# EAGLE design base-6u-generic-xau4 (EAGLE 6.2)
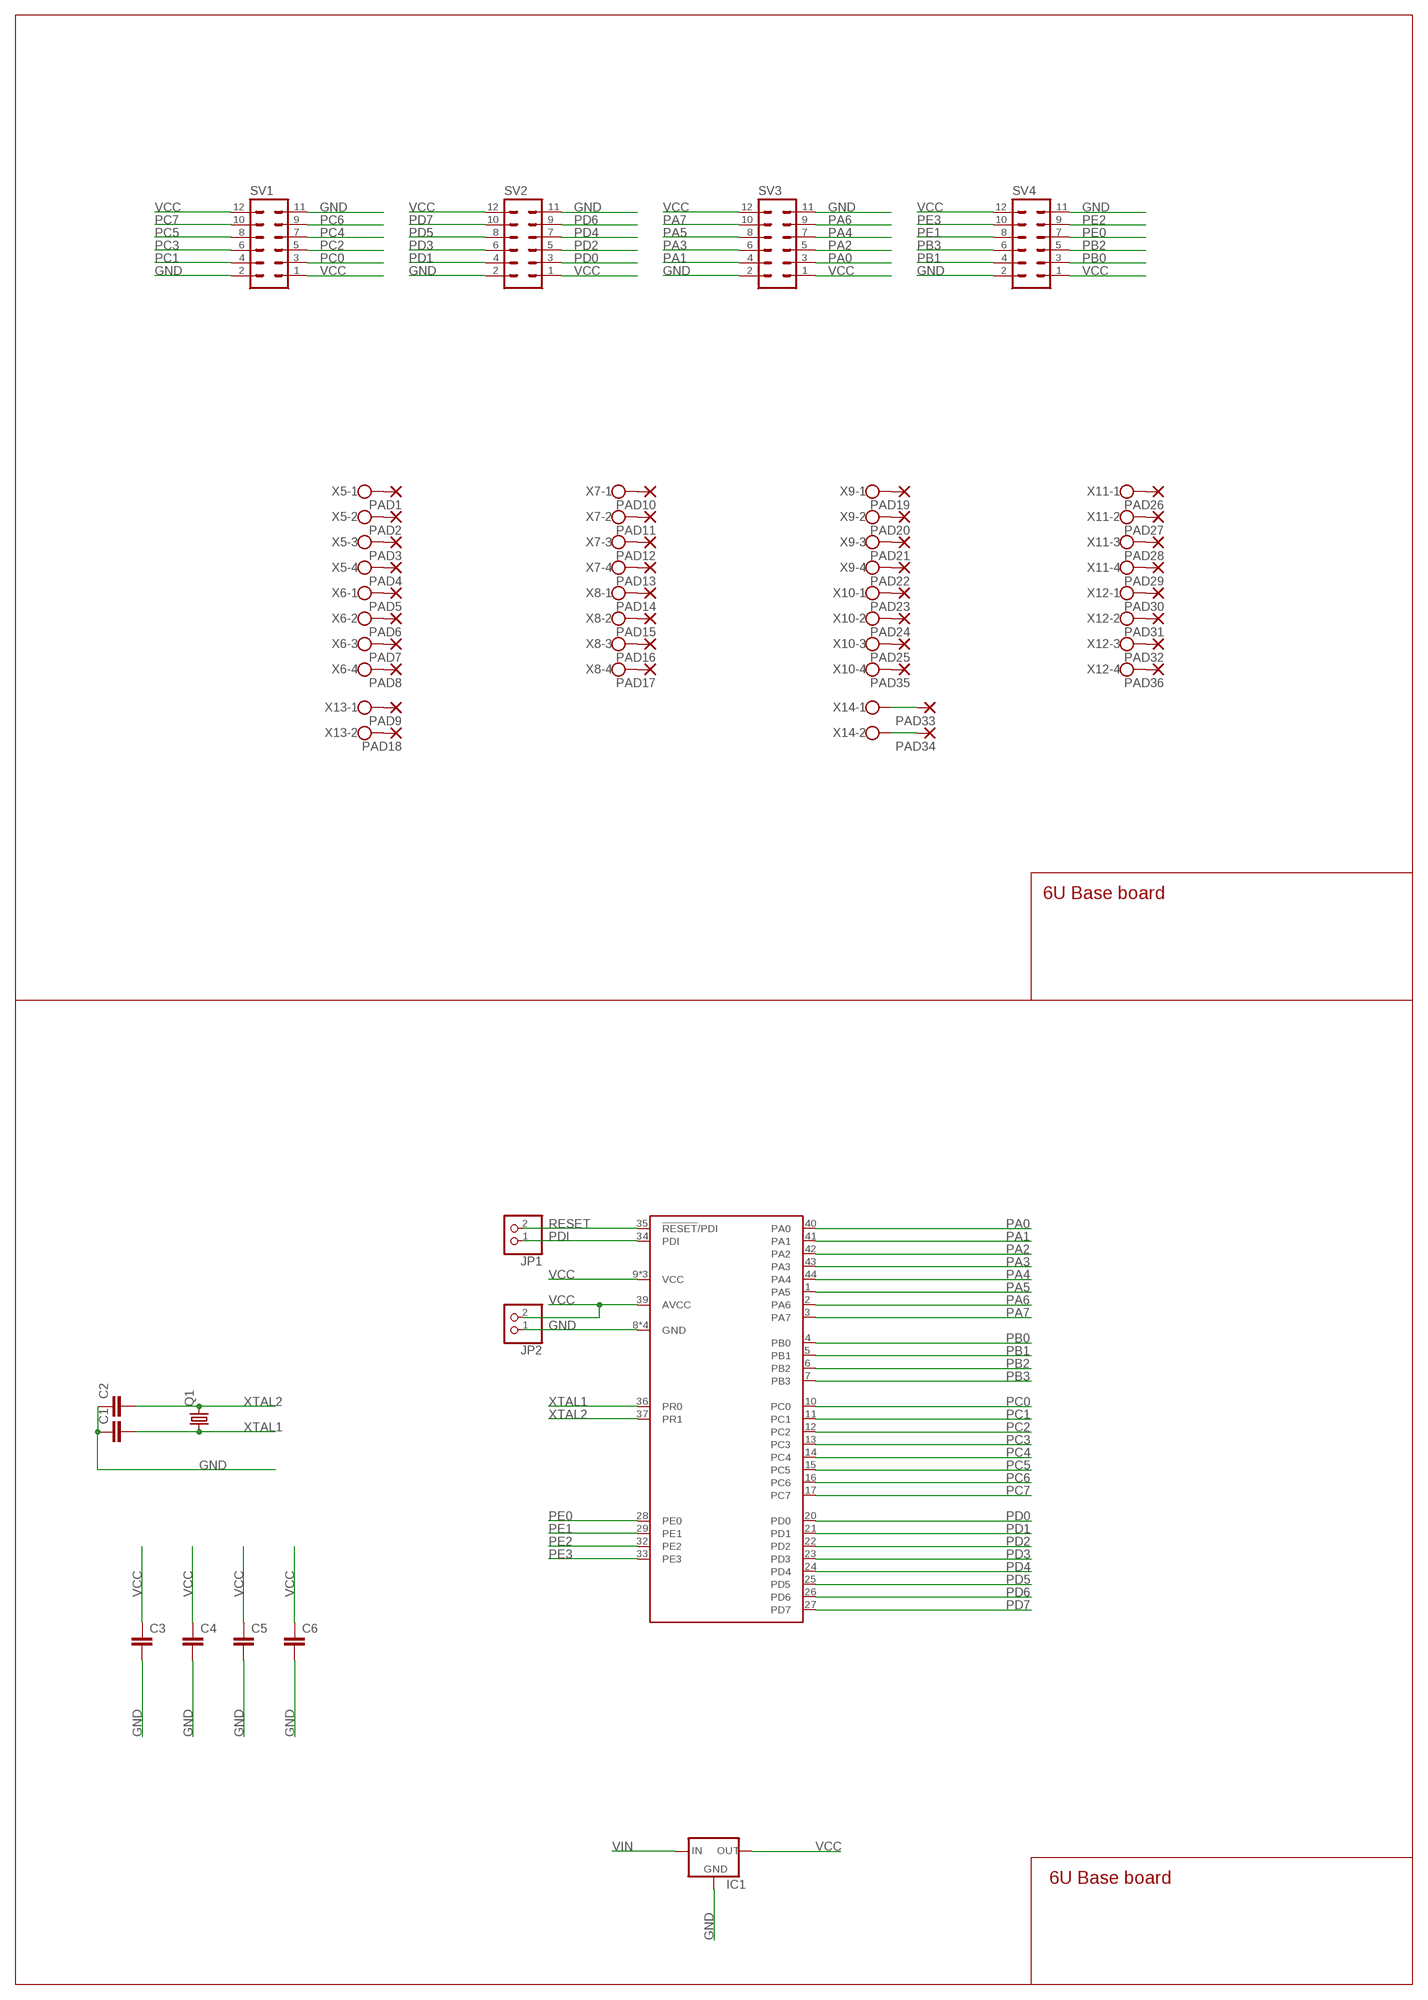
[diagram p0: schematic, sheet 1]

## Parts
C1  C-EUC0805  [C0805]
C2  C-EUC0805  [C0805]
C3  C-EUC0603  [C0603]
C4  C-EUC0603  [C0603]
C5  C-EUC0603  [C0603]
C6  C-EUC0603  [C0603]
IC1  LM1117TO252  [TO252]
JP1  PINHD-1X2  [1X02]
JP2  PINHD-1X2  [1X02]
PAD1  2,54/0,8  [2,54/0,8]
PAD2  2,54/0,8  [2,54/0,8]
PAD3  2,54/0,8  [2,54/0,8]
PAD4  2,54/0,8  [2,54/0,8]
PAD5  2,54/0,8  [2,54/0,8]
PAD6  2,54/0,8  [2,54/0,8]
PAD7  2,54/0,8  [2,54/0,8]
PAD8  2,54/0,8  [2,54/0,8]
PAD9  2,54/0,8  [2,54/0,8]
PAD10  2,54/0,8  [2,54/0,8]
PAD11  2,54/0,8  [2,54/0,8]
PAD12  2,54/0,8  [2,54/0,8]
PAD13  2,54/0,8  [2,54/0,8]
PAD14  2,54/0,8  [2,54/0,8]
PAD15  2,54/0,8  [2,54/0,8]
PAD16  2,54/0,8  [2,54/0,8]
PAD17  2,54/0,8  [2,54/0,8]
PAD18  2,54/0,8  [2,54/0,8]
PAD19  2,54/0,8  [2,54/0,8]
PAD20  2,54/0,8  [2,54/0,8]
PAD21  2,54/0,8  [2,54/0,8]
PAD22  2,54/0,8  [2,54/0,8]
PAD23  2,54/0,8  [2,54/0,8]
PAD24  2,54/0,8  [2,54/0,8]
PAD25  2,54/0,8  [2,54/0,8]
PAD26  2,54/0,8  [2,54/0,8]
PAD27  2,54/0,8  [2,54/0,8]
PAD28  2,54/0,8  [2,54/0,8]
PAD29  2,54/0,8  [2,54/0,8]
PAD30  2,54/0,8  [2,54/0,8]
PAD31  2,54/0,8  [2,54/0,8]
PAD32  2,54/0,8  [2,54/0,8]
PAD33  2,54/0,8  [2,54/0,8]
PAD34  2,54/0,8  [2,54/0,8]
PAD35  2,54/0,8  [2,54/0,8]
PAD36  2,54/0,8  [2,54/0,8]
Q1  CRYSTALHC49S  [HC49/S]
SV1  MA06-2  [MA06-2]
SV2  MA06-2  [MA06-2]
SV3  MA06-2  [MA06-2]
SV4  MA06-2  [MA06-2]
U1  ATXMEGA32A4U-AU  [TQFP-44A-44]
X5  W237-4  [W237-4]
X6  W237-4  [W237-4]
X7  W237-4  [W237-4]
X8  W237-4  [W237-4]
X9  W237-4  [W237-4]
X10  W237-4  [W237-4]
X11  W237-4  [W237-4]
X12  W237-4  [W237-4]
X13  W237-102  [W237-102]
X14  W237-102  [W237-102]

## Nets
GND: C1.1 C2.1 C3.2 C4.2 C5.2 C6.2 IC1.1(GND) JP2.1 PAD33.1(P) SV1.2 SV1.11 SV2.2 SV2.11 SV3.2 SV3.11 SV4.2 SV4.11 U1.8(GND) U1.18(GND) U1.30(GND) U1.38(GND) X14.1
N$1: PAD1.1(P) X5.1
N$2: PAD2.1(P) X5.2
N$3: PAD3.1(P) X5.3
N$4: PAD4.1(P) X5.4
N$5: PAD5.1(P) X6.1
N$6: PAD6.1(P) X6.2
N$7: PAD7.1(P) X6.3
N$8: PAD8.1(P) X6.4
N$9: PAD9.1(P) X13.1
N$10: PAD10.1(P) X7.1
N$11: PAD11.1(P) X7.2
N$12: PAD12.1(P) X7.3
N$13: PAD13.1(P) X7.4
N$14: PAD14.1(P) X8.1
N$15: PAD15.1(P) X8.2
N$16: PAD16.1(P) X8.3
N$17: PAD17.1(P) X8.4
N$18: PAD18.1(P) X13.2
N$19: PAD26.1(P) X11.1
N$20: PAD27.1(P) X11.2
N$21: PAD28.1(P) X11.3
N$22: PAD29.1(P) X11.4
N$23: PAD30.1(P) X12.1
N$24: PAD31.1(P) X12.2
N$25: PAD32.1(P) X12.3
N$26: PAD19.1(P) X9.1
N$27: PAD20.1(P) X9.2
N$28: PAD21.1(P) X9.3
N$29: PAD22.1(P) X9.4
N$30: PAD23.1(P) X10.1
N$31: PAD24.1(P) X10.2
N$32: PAD25.1(P) X10.3
N$33: PAD35.1(P) X10.4
N$34: PAD36.1(P) X12.4
PA0: SV3.3 U1.40(PA0)
PA1: SV3.4 U1.41(PA1)
PA2: SV3.5 U1.42(PA2)
PA3: SV3.6 U1.43(PA3)
PA4: SV3.7 U1.44(PA4)
PA5: SV3.8 U1.1(PA5)
PA6: SV3.9 U1.2(PA6)
PA7: SV3.10 U1.3(PA7)
PB0: SV4.3 U1.4(PB0)
PB1: SV4.4 U1.5(PB1)
PB2: SV4.5 U1.6(PB2)
PB3: SV4.6 U1.7(PB3)
PC0: SV1.3 U1.10(PC0)
PC1: SV1.4 U1.11(PC1)
PC2: SV1.5 U1.12(PC2)
PC3: SV1.6 U1.13(PC3)
PC4: SV1.7 U1.14(PC4)
PC5: SV1.8 U1.15(PC5)
PC6: SV1.9 U1.16(PC6)
PC7: SV1.10 U1.17(PC7)
PD0: SV2.3 U1.20(PD0)
PD1: SV2.4 U1.21(PD1)
PD2: SV2.5 U1.22(PD2)
PD3: SV2.6 U1.23(PD3)
PD4: SV2.7 U1.24(PD4)
PD5: SV2.8 U1.25(PD5)
PD6: SV2.9 U1.26(PD6)
PD7: SV2.10 U1.27(PD7)
PDI: JP1.1 U1.34(PDI)
PE0: SV4.7 U1.28(PE0)
PE1: SV4.8 U1.29(PE1)
PE2: SV4.9 U1.32(PE2)
PE3: SV4.10 U1.33(PE3)
RESET: JP1.2 U1.35(!RESET!/PDI)
VCC: C3.1 C4.1 C5.1 C6.1 IC1.3(OUT) JP2.2 SV1.1 SV1.12 SV2.1 SV2.12 SV3.1 SV3.12 SV4.1 SV4.12 U1.9(VCC) U1.19(VCC) U1.31(VCC) U1.39(AVCC)
VIN: IC1.2(IN) PAD34.1(P) X14.2
XTAL1: C1.2 Q1.1 U1.36(PR0)
XTAL2: C2.2 Q1.2 U1.37(PR1)

## Notes on the sheet
- 6U Base board
- 6U Base board

## Library data of the parts
C1-C6 = rcl:C-EU: CAPACITOR, European symbol
IC1 = my-v-reg-3:LM1117
JP1 JP2 = pinhead:PINHD-1X2: PIN HEADER
PAD1-PAD36 = wirepad:2,54/0,8: THROUGH-HOLE PAD
Q1 = crystal:CRYSTAL: CRYSTAL
SV1-SV4 = con-lstb:MA06-2: PIN HEADER; OC_FARNELL: unknown; OC_NEWARK: unknown
U1 = atmel-xmega:ATXMEGA32A4U: 8/16-bit XMEGA A4U Microcontroller Features High-performance, low-power Atmel® AVR® XMEGA® 8/16-bit Microcontroller Nonvolatile program and data memories – 16K - 128KBytes of in-system self-programmable flash – 4K - 8KBytes boot section – 1K - 2KBytes EEPROM – 2K - 8KBytes internal SRAM Peripheral Features – Four-channel DMA controller – Eight-channel event system – Five 16-bit timer/counters Three timer/counters with 4 output compare or input capture channels Two timer/counters with 2 output compare or input capture channels High-resolution extensions on all timer/counters Advanced waveform extension (AWeX) on one timer/counter – One USB device interface USB 2.0 full speed (12Mbps) and low speed (1.5Mbps) device compliant 32 Endpoints with full configuration flexibility – Five USARTs with IrDA support for one USART – Two Two-wire interfaces with dual address match (I2C and SMBus compatible) – Two serial peripheral interfaces (SPIs) – AES and DES crypto engine – CRC-16 (CRC-CCITT) and CRC-32 (IEEE® 802.3) generator – 16-bit real time counter (RTC) with separate oscillator – One twelve-channel, 12-bit, 2mspsAnalog to Digital Converter – One two-channel, 12-bit, 1msps Digital to Analog Converter – Two Analog Comparators with window compare function, and current sources – External interrupts on all general purpose I/O pins – Programmable watchdog timer with separate on-chip ultra low power oscillator – QTouch® library support Capacitive touch buttons, sliders and wheels Special microcontroller features – Power-on reset and programmable brown-out detection – Internal and external clock options with PLL and prescaler – Programmable multilevel interrupt controller – Five sleep modes – Programming and debug interfaces PDI (program and debug interface) I/O and packages – 34 Programmable I/O pins – 44 - lead TQFP – 44 - pad VQFN/QFN – 49 - ball VFBGA Operating voltage – 1.6 – 3.6V Operating frequency – 0 – 12MHz from 1.6V – 0 – 32MHz from 2.7V
X5-X12 = con-wago-500:W237-4: WAGO SCREW CLAMP; OC_FARNELL: unknown; OC_NEWARK: unknown
X13 X14 = con-wago-500:W237-102: WAGO SCREW CLAMP; MPN: 237-102; OC_FARNELL: unknown; OC_NEWARK: 70K9898

## Board
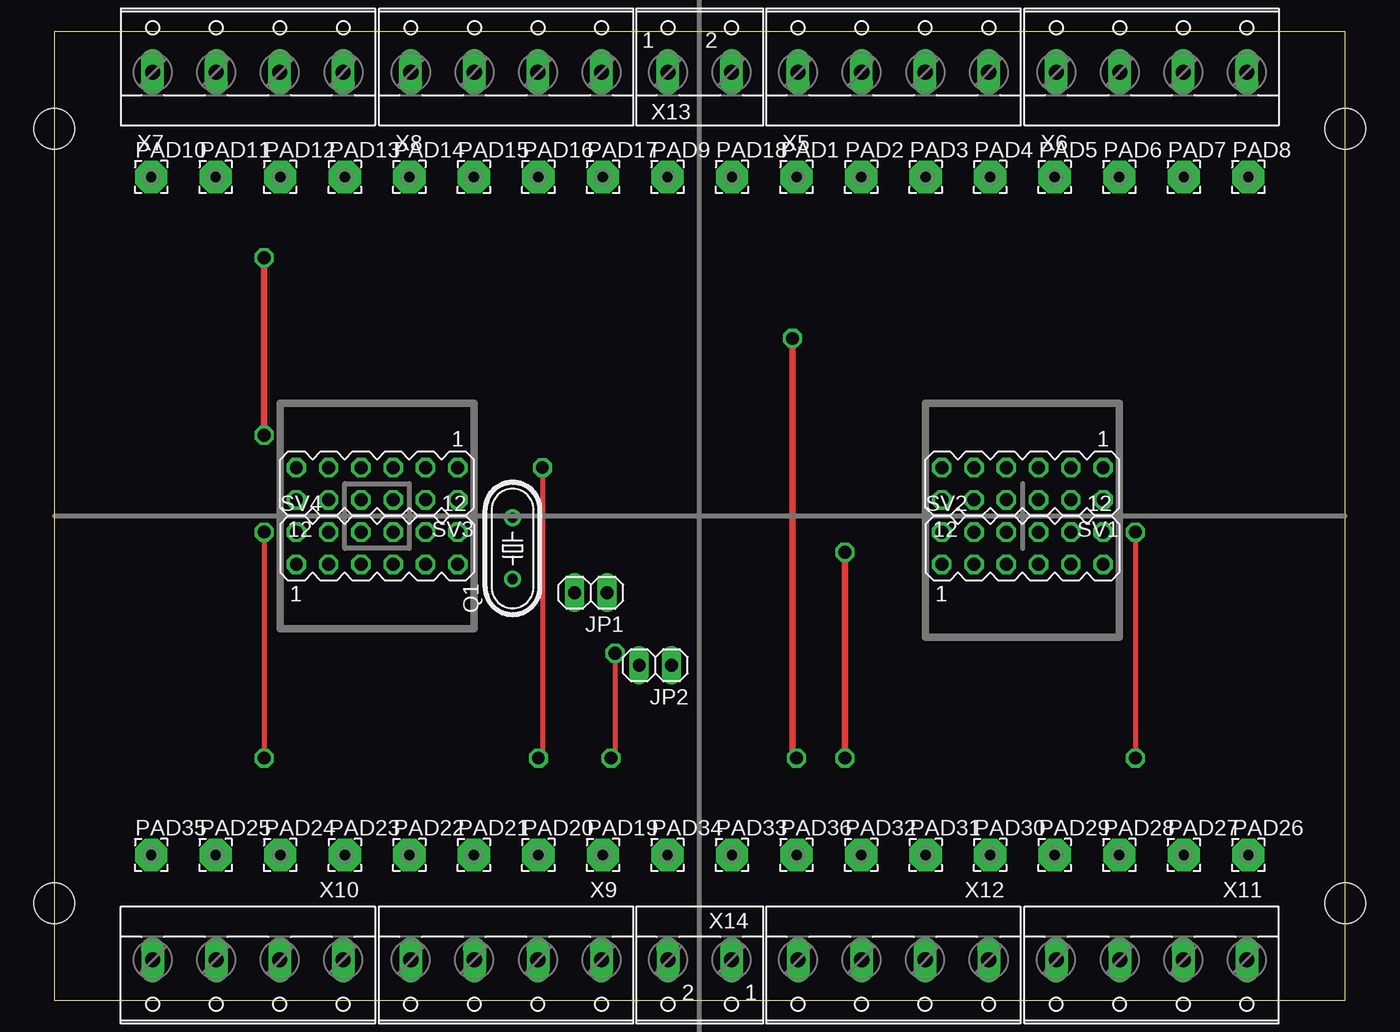
[diagram p1: board, top side]
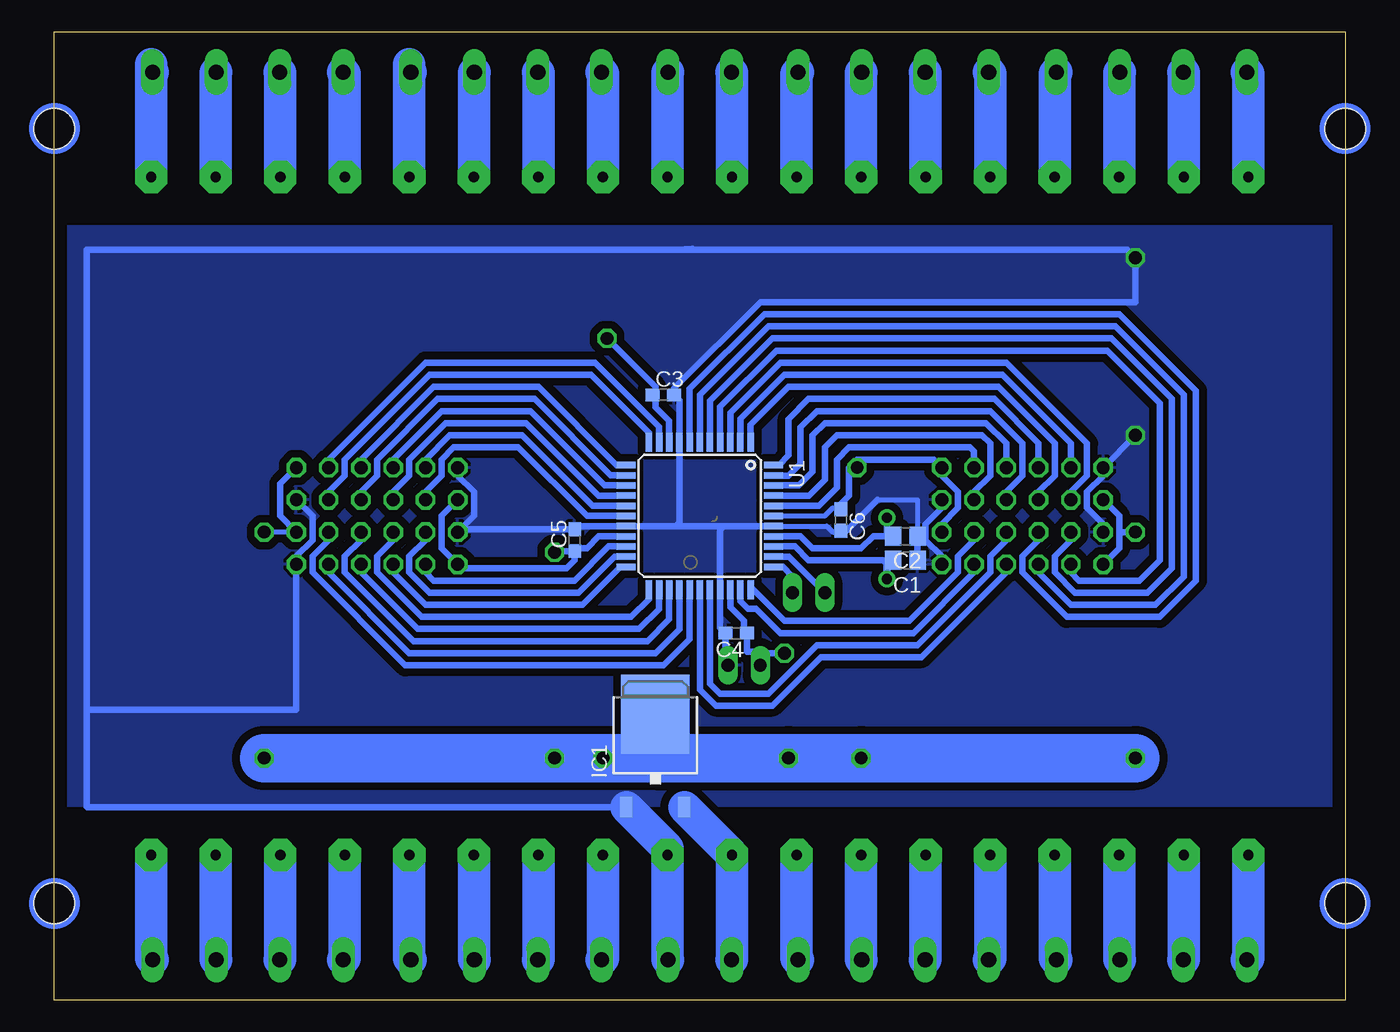
[diagram p2: board, bottom side, seen from below]

Size 101.6 x 76.2 mm. Coordinates in mm from the lower left corner, seen from the top.
Outline: 0,0 101.6,0 101.6,76.2 0,76.2 0,0
Copper layers (1*16): Top 0.035mm / dielectric 1.5mm / Bottom 0.035mm
Design rules: minimum track width 10mil, minimum drill 24mil, track to track 8mil, track to pad 8mil, pad to pad 8mil, via to via 8mil, smd to smd 8mil, copper to edge 40mil, drill to drill 8mil, minimum pad ring 10mil, minimum via ring 8mil, stop-mask expansion 4mil, vias tented up to drill 0mil, thermal gap 10mil
Holes 3.2 mm at 0,7.62 0,68.58 101.6,7.62 101.6,68.58
bRestrict: area -3.8,3.8 to 3.8,11.4; area 97.8,3.8 to 105.4,11.4; area -3.8,64.8 to 3.8,72.4; area 97.8,64.8 to 105.4,72.4

### Footprints (pad centres in the part's own frame; a part is rotated, then mirrored left to right if it is on the bottom)
C0805 = smd 1.3 x 1.5: 1 -0.95,0; 2 0.95,0
C0603 = smd 1.1 x 1: 1 -0.85,0; 2 0.85,0
TO252 = smd 1 x 1.6: 1 -2.28,-6.07; 2 2.28,-6.07 | smd 5.4 x 6.2: 3 0,1.23
1X02 = drill 1.016 long: 1 -1.27,0; 2 1.27,0
2,54/0,8 = drill 0.813 pad 2.54 octagon: 1 0,0
HC49/S = drill 0.813: 1 -2.413,0; 2 2.413,0
MA06-2 = drill 1.016 octagon: 1 -6.35,-1.27; 2 -6.35,1.27; 3 -3.81,-1.27; 4 -3.81,1.27; 5 -1.27,-1.27; 6 -1.27,1.27; 7 1.27,-1.27; 8 1.27,1.27; 9 3.81,-1.27; 10 3.81,1.27; 11 6.35,-1.27; 12 6.35,1.27
TQFP-44A-44 = smd 1.5 x 0.5: 1 -5.8,4; 2 -5.8,3.2; 3 -5.8,2.4; 4 -5.8,1.6; 5 -5.8,0.8; 6 -5.8,0; 7 -5.8,-0.8; 8 -5.8,-1.6; 9 -5.8,-2.4; 10 -5.8,-3.2; 11 -5.8,-4; 23 5.8,-4; 24 5.8,-3.2; 25 5.8,-2.4; 26 5.8,-1.6; 27 5.8,-0.8; 28 5.8,0; 29 5.8,0.8; 30 5.8,1.6; 31 5.8,2.4; 32 5.8,3.2; 33 5.8,4 | smd 0.5 x 1.5: 12 -4,-5.8; 13 -3.2,-5.8; 14 -2.4,-5.8; 15 -1.6,-5.8; 16 -0.8,-5.8; 17 0,-5.8; 18 0.8,-5.8; 19 1.6,-5.8; 20 2.4,-5.8; 21 3.2,-5.8; 22 4,-5.8; 34 4,5.8; 35 3.2,5.8; 36 2.4,5.8; 37 1.6,5.8; 38 0.8,5.8; 39 0,5.8; 40 -0.8,5.8; 41 -1.6,5.8; 42 -2.4,5.8; 43 -3.2,5.8; 44 -4,5.8
W237-4 = drill 1.194 long: 1 -7.5,-1.27; 2 -2.5,-1.27; 3 2.5,-1.27; 4 7.5,-1.27
W237-102 = drill 1.194 long: 1 -2.5,-1.27; 2 2.5,-1.27

### Placement (x,y rotation side)
C1  34.61,34.61 180 bottom
C2  34.61,36.51 180 bottom
C3  53.66,47.62 0 bottom
C4  47.94,28.89 180 bottom
C5  60.64,36.2 90 bottom
C6  39.69,37.78 270 bottom
IC1  54.29,21.27 0 bottom
JP1  42.23,32.07 180 top
JP2  47.31,26.35 180 top
PAD1  58.42,64.77 0 top
PAD2  63.5,64.77 0 top
PAD3  68.58,64.77 0 top
PAD4  73.66,64.77 0 top
PAD5  78.74,64.77 0 top
PAD6  83.82,64.77 0 top
PAD7  88.9,64.77 0 top
PAD8  93.98,64.77 0 top
PAD9  48.26,64.77 0 top
PAD10  7.62,64.77 0 top
PAD11  12.7,64.77 0 top
PAD12  17.78,64.77 0 top
PAD13  22.86,64.77 0 top
PAD14  27.94,64.77 0 top
PAD15  33.02,64.77 0 top
PAD16  38.1,64.77 0 top
PAD17  43.18,64.77 0 top
PAD18  53.34,64.77 0 top
PAD19  43.18,11.43 0 top
PAD20  38.1,11.43 0 top
PAD21  33.02,11.43 0 top
PAD22  27.94,11.43 0 top
PAD23  22.86,11.43 0 top
PAD24  17.78,11.43 0 top
PAD25  12.7,11.43 0 top
PAD26  93.98,11.43 0 top
PAD27  88.9,11.43 0 top
PAD28  83.82,11.43 0 top
PAD29  78.74,11.43 0 top
PAD30  73.66,11.43 0 top
PAD31  68.58,11.43 0 top
PAD32  63.5,11.43 0 top
PAD33  53.34,11.43 0 top
PAD34  48.26,11.43 0 top
PAD35  7.62,11.43 0 top
PAD36  58.42,11.43 0 top
Q1  36.07,35.55 90 top
SV1  76.2,40.64 180 top
SV2  76.2,35.56 0 top
SV3  25.4,40.64 180 top
SV4  25.4,35.56 0 top
U1  50.8,38.1 270 bottom
X5  66.04,74.29 0 top
X6  86.36,74.29 0 top
X7  15.24,74.29 0 top
X8  35.56,74.29 0 top
X9  35.56,1.91 180 top
X10  15.24,1.91 180 top
X11  86.36,1.91 180 top
X12  66.04,1.91 180 top
X13  50.8,74.29 0 top
X14  50.8,1.91 180 top

### Tracks (layer width: path | path; a pad name or v marks a point on that pad's centre or on a via)
GND  (via drill 1)
  Top 0.508: v16.51,58.42 v16.51,44.45
  Bottom 0.406: U1.38 40.79,37.3 40.32,36.83 39.79,36.83 C6.2 | 36.83,39.37 33.66,39.37 C2.1
  Bottom 0.508: SV4.2 19.05,37.47 20.32,38.73 20.32,40.01 19.05,41.27 SV3.11 v16.51,44.45 | 33.02,36.51 33.02,37.47 31.75,38.73 SV3.2 | 33.02,36.51 33.02,36.2 31.75,34.93 SV4.11 | C1.1 C2.1 33.02,36.51 | C6.2 39.27,36.93 36.83,39.37 | SV1.11 69.85,41.27 68.58,40.01 68.58,38.1 SV2.2 69.64,37.05 C5.2 60.39,37.3 U1.18 52.7,37.3 | U1.38 48.9,37.3 | 48.9,37.3 52.7,37.3 | 48.9,37.3 49.2,36.99 U1.30 49.2,29.3 C4.2 48.79,26.57 JP2.1 | 52.7,37.3 52.4,37.61 U1.8 52.4,47.22 C3.2 52.81,48.16 46.04,54.93 16.51,54.93 v16.51,58.42 17.14,59.05 52.7,59.05 | SV1.2 81.28,38.1 81.28,36.2 82.55,34.93 SV2.11 82.55,22.86 99.06,22.86 | 51.38,59.11 52.7,59.05 | 52.7,59.05 99.06,59.05 99.06,22.86 | IC1.1 99.02,15.2 99.06,15.24 99.06,22.86
  Bottom 2.54: X14.1 53.34,3.21 PAD33.1 53.34,11.97 IC1.1
  pour Bottom (isolate 0.61): 0,15.24 101.6,15.24 101.6,60.96 0,60.96
N$1
  Bottom 2.54: PAD1.1 58.42,72.9 X5.1
N$2
  Bottom 2.54: PAD2.1 63.5,72.98 X5.2
N$3
  Bottom 2.54: PAD3.1 68.58,72.98 X5.3
N$4
  Bottom 2.54: PAD4.1 73.66,73.14 | 73.66,73.66 73.66,73.14 | 73.66,73.14 X5.4
N$5
  Bottom 2.54: PAD5.1 78.74,72.9 X6.1
N$6
  Bottom 2.54: PAD6.1 83.82,72.98 X6.2
N$7
  Bottom 2.54: PAD7.1 88.9,72.98 X6.3
N$8
  Bottom 2.54: PAD8.1 93.98,73.14 | 93.98,73.66 93.98,73.14 | 93.98,73.14 X6.4
N$9
  Bottom 2.54: PAD9.1 48.26,72.98 X13.1
N$10
  Bottom 2.54: PAD10.1 7.62,72.9 X7.1
N$11
  Bottom 2.54: PAD11.1 12.7,72.98 X7.2
N$12
  Bottom 2.54: PAD12.1 17.78,72.98 X7.3
N$13
  Bottom 2.54: PAD13.1 22.86,72.9 X7.4
N$14
  Bottom 2.54: PAD14.1 27.94,72.9 X8.1
N$15
  Bottom 2.54: PAD15.1 33.02,72.98 X8.2
N$16
  Bottom 2.54: PAD16.1 38.1,72.98 X8.3
N$17
  Bottom 2.54: PAD17.1 43.18,72.9 X8.4
N$18
  Bottom 2.54: PAD18.1 53.34,72.98 X13.2
N$19
  Bottom 2.54: PAD26.1 93.98,3.29 X11.1
N$20
  Bottom 2.54: PAD27.1 88.9,3.21 X11.2
N$21
  Bottom 2.54: PAD28.1 83.82,3.21 X11.3
N$22
  Bottom 2.54: PAD29.1 78.74,3.29 X11.4
N$23
  Bottom 2.54: PAD30.1 73.66,3.29 X12.1
N$24
  Bottom 2.54: PAD31.1 68.58,3.21 X12.2
N$25
  Bottom 2.54: PAD32.1 63.5,3.21 X12.3
N$26
  Bottom 2.54: PAD19.1 43.18,3.29 X9.1
N$27
  Bottom 2.54: PAD20.1 38.1,3.21 X9.2
N$28
  Bottom 2.54: PAD21.1 33.02,3.21 X9.3
N$29
  Bottom 2.54: PAD22.1 27.94,3.29 X9.4
N$30
  Bottom 2.54: PAD23.1 22.86,3.29 X10.1
N$31
  Bottom 2.54: PAD24.1 17.78,3.21 X10.2
N$32
  Bottom 2.54: PAD25.1 12.7,3.21 X10.3
N$33
  Bottom 2.54: PAD35.1 7.62,3.29 X10.4
N$34
  Bottom 2.54: PAD36.1 58.42,3.29 X12.4
PA0
  Bottom 0.508: SV3.3 29.21,43.18 29.53,43.5 39.05,43.5 40.01,42.55 40.01,40.32 41.43,38.9 U1.40
PA1
  Bottom 0.508: SV3.4 29.21,40.01 27.94,41.27 27.94,43.81 28.57,44.45 40.01,44.45 40.96,43.5 40.96,40.96 42.22,39.7 U1.41
PA2
  Bottom 0.508: SV3.5 26.67,43.81 28.26,45.4 40.96,45.4 41.91,44.45 41.91,41.59 43,40.5 U1.42
PA3
  Bottom 0.508: SV3.6 26.67,40.01 25.4,41.27 25.4,43.81 27.94,46.36 41.59,46.36 42.86,45.09 42.86,42.23 43.81,41.27 44.98,41.27 U1.43
PA4
  Bottom 0.508: SV3.7 24.13,43.81 27.62,47.31 42.23,47.31 43.81,45.72 43.81,42.86 44.58,42.1 U1.44
PA5
  Bottom 0.508: SV3.8 24.13,40.01 22.86,41.27 22.86,43.81 27.3,48.26 43.81,48.26 46.8,45.27 U1.1
PA6
  Bottom 0.508: SV3.9 21.59,43.81 26.99,49.21 44.13,49.21 47.6,45.74 U1.2
PA7
  Bottom 0.508: SV3.10 21.59,40.01 20.32,41.27 20.32,43.81 26.67,50.16 44.45,50.16 48.4,46.22 U1.3
PB0
  Bottom 0.508: U1.4 49.2,46.69 44.77,51.12 18.73,51.12 14.61,46.99 14.61,34.61 16.19,33.02 20.95,33.02 21.59,33.66 SV4.3
PB1
  Bottom 0.508: U1.5 50,47.16 45.09,52.07 18.41,52.07 13.65,47.31 13.65,33.97 15.56,32.07 21.27,32.07 22.86,33.66 22.86,34.93 21.59,36.2 SV4.4
PB2
  Bottom 0.508: U1.6 50.8,47.62 45.4,53.02 18.1,53.02 12.7,47.62 12.7,33.34 14.92,31.12 21.59,31.12 24.13,33.66 SV4.5
PB3
  Bottom 0.508: U1.7 51.6,48.09 45.72,53.98 17.78,53.98 11.75,47.94 11.75,33.02 14.61,30.16 21.91,30.16 25.4,33.66 25.4,34.93 24.13,36.2 SV4.6
PC0
  Bottom 0.508: U1.10 54,45.11 59.05,50.16 72.39,50.16 80.01,42.55 SV1.3
PC1
  Bottom 0.508: SV1.4 80.01,40.01 78.74,41.27 78.74,42.55 72.07,49.21 59.37,49.21 54.8,44.64 U1.11
PC2
  Bottom 0.508: SV1.5 77.47,42.55 71.75,48.26 63.5,48.26 57.34,42.1 U1.12
PC3
  Bottom 0.508: U1.13 57.81,41.3 63.82,47.31 71.44,47.31 76.2,42.55 76.2,41.27 77.47,40.01 SV1.6
PC4
  Bottom 0.508: U1.14 58.28,40.5 64.14,46.36 71.12,46.36 74.93,42.55 SV1.7
PC5
  Bottom 0.508: U1.15 58.75,39.7 64.45,45.4 70.8,45.4 73.66,42.55 73.66,41.27 74.93,40.01 SV1.8
PC6
  Bottom 0.508: U1.16 59.22,38.9 64.77,44.45 70.48,44.45 72.39,42.55 SV1.9
PC7
  Bottom 0.508: U1.17 59.69,38.1 65.09,43.5 70.17,43.5 71.12,42.55 71.12,41.27 72.39,40.01 SV1.10
PD0
  Bottom 0.508: SV2.3 72.39,33.66 71.75,33.02 60.64,33.02 57.96,35.7 U1.20
PD1
  Bottom 0.508: U1.21 57.49,34.9 60.33,32.07 72.07,32.07 73.66,33.66 73.66,34.93 72.39,36.2 SV2.4
PD2
  Bottom 0.508: U1.22 57.02,34.1 60.01,31.12 72.39,31.12 74.93,33.66 SV2.5
PD3
  Bottom 0.508: U1.23 54.8,31.56 56.2,30.16 72.71,30.16 76.2,33.66 76.2,34.93 74.93,36.2 SV2.6
PD4
  Bottom 0.508: U1.24 54,30.77 55.56,29.21 73.03,29.21 77.47,33.66 SV2.7
PD5
  Bottom 0.508: U1.25 53.2,29.98 54.93,28.26 73.34,28.26 78.74,33.66 78.74,34.93 77.47,36.2 SV2.8
PD6
  Bottom 0.508: U1.26 52.4,29.2 54.29,27.3 73.66,27.3 80.01,33.66 SV2.9
PD7
  Bottom 0.508: U1.27 51.6,28.41 53.66,26.35 73.98,26.35 81.28,33.66 81.28,34.93 80.01,36.2 SV2.10
PDI
  Bottom 0.508: U1.34 44.26,34.1 43.5,33.34 JP1.1
PE0
  Bottom 0.508: SV4.7 26.67,33.66 33.34,26.99 41.27,26.99 45.09,23.18 49.53,23.18 50.8,24.45 U1.28
PE1
  Bottom 0.508: SV4.8 26.67,36.2 27.94,34.93 27.94,33.66 33.66,27.94 41.59,27.94 45.4,24.13 49.21,24.13 50,24.92 U1.29
PE2
  Bottom 0.508: SV4.9 29.21,33.66 33.97,28.89 44.45,28.89 46.35,30.8 46.99,30.8 47.6,31.41 U1.32
PE3
  Bottom 0.508: SV4.10 29.21,36.2 30.48,34.93 30.48,33.66 34.29,29.84 44.13,29.84 46.59,32.3 U1.33
RESET
  Bottom 0.508: U1.35 43.79,34.9 JP1.2
VCC  (via drill 1)
  Top 0.406: v16.51,36.83 v16.51,19.05 | v38.42,41.91 38.42,19.37 v38.1,19.05 | v44.13,27.3 44.13,19.37 v43.81,19.05 | v85.09,36.83 v85.09,19.05
  Top 0.508: v62.23,35.24 v62.23,19.05 | v58.1,52.07 58.1,19.37 v58.42,19.05
  Bottom 0.406: U1.39 40.96,38.1 40.32,38.73 39.79,38.73 C6.1 | SV2.12 v85.09,36.83
  Bottom 0.508: SV3.12 17.78,38.1 17.78,36.83 | SV4.1 17.78,35.56 17.78,36.83 | SV4.12 31.75,37.47 30.48,38.73 30.48,40.01 31.75,41.27 SV3.1 32.38,42.55 38.42,42.55 39.05,41.91 | 39.05,41.91 39.05,39.69 39.69,39.05 C6.1 | U1.19 58.75,36.5 59.69,35.56 60.43,35.56 C5.1 | SV1.12 71.12,38.1 71.12,35.56 SV2.1 69.53,33.97 61.28,33.97 60.64,34.61 C5.1 | C5.1 62.13,35.34 v62.23,35.24 | U1.9 53.2,45.58 54.29,46.67 54.29,47.41 | 54.29,47.41 C3.1 | 17.78,36.83 v16.51,36.83 | SV1.1 83.82,40.64 83.82,38.1 SV2.12 | U1.31 48.4,30.94 47.31,29.84 47.31,29.11 C4.1 47.09,27.41 46.14,27.41 46.04,27.3 | JP2.2 46.04,27.3 | 46.04,27.3 v44.13,27.3 | 54.29,47.41 54.29,48.26 v58.1,52.07 | v38.42,41.91 39.05,41.91
  Bottom 3.81: IC1.3 54.29,19.05 | 54.29,19.05 v43.81,19.05 v38.1,19.05 v16.51,19.05 | 54.29,19.05 v58.42,19.05 v62.23,19.05 v85.09,19.05
VIN
  Bottom 2.54: X14.2 48.26,3.21 PAD34.1 48.26,11.45 IC1.2
XTAL1
  Bottom 0.508: U1.36 43.32,35.7 42.23,34.61 36.39,34.61 36.07,34.29
  Bottom 0.61: Q1.1 36.07,34.29 36.07,34.48 C1.2
XTAL2
  Bottom 0.508: U1.37 44.99,36.51 42.86,36.51 41.91,35.56 38.1,35.56 37.15,36.51 C2.2 36.2,36.51 36.51,36.51 | Q1.2 36.07,36.64
  Bottom 0.61: C2.2 36.07,36.64
(copper drawn outside any net)
  shapes: Bottom circle x4

### Text on the board
tDocu: ERRORS